# Altium schematic sheet Sheet5.SchDoc
size A4; SheetNumber: 5; SheetTotal: 6
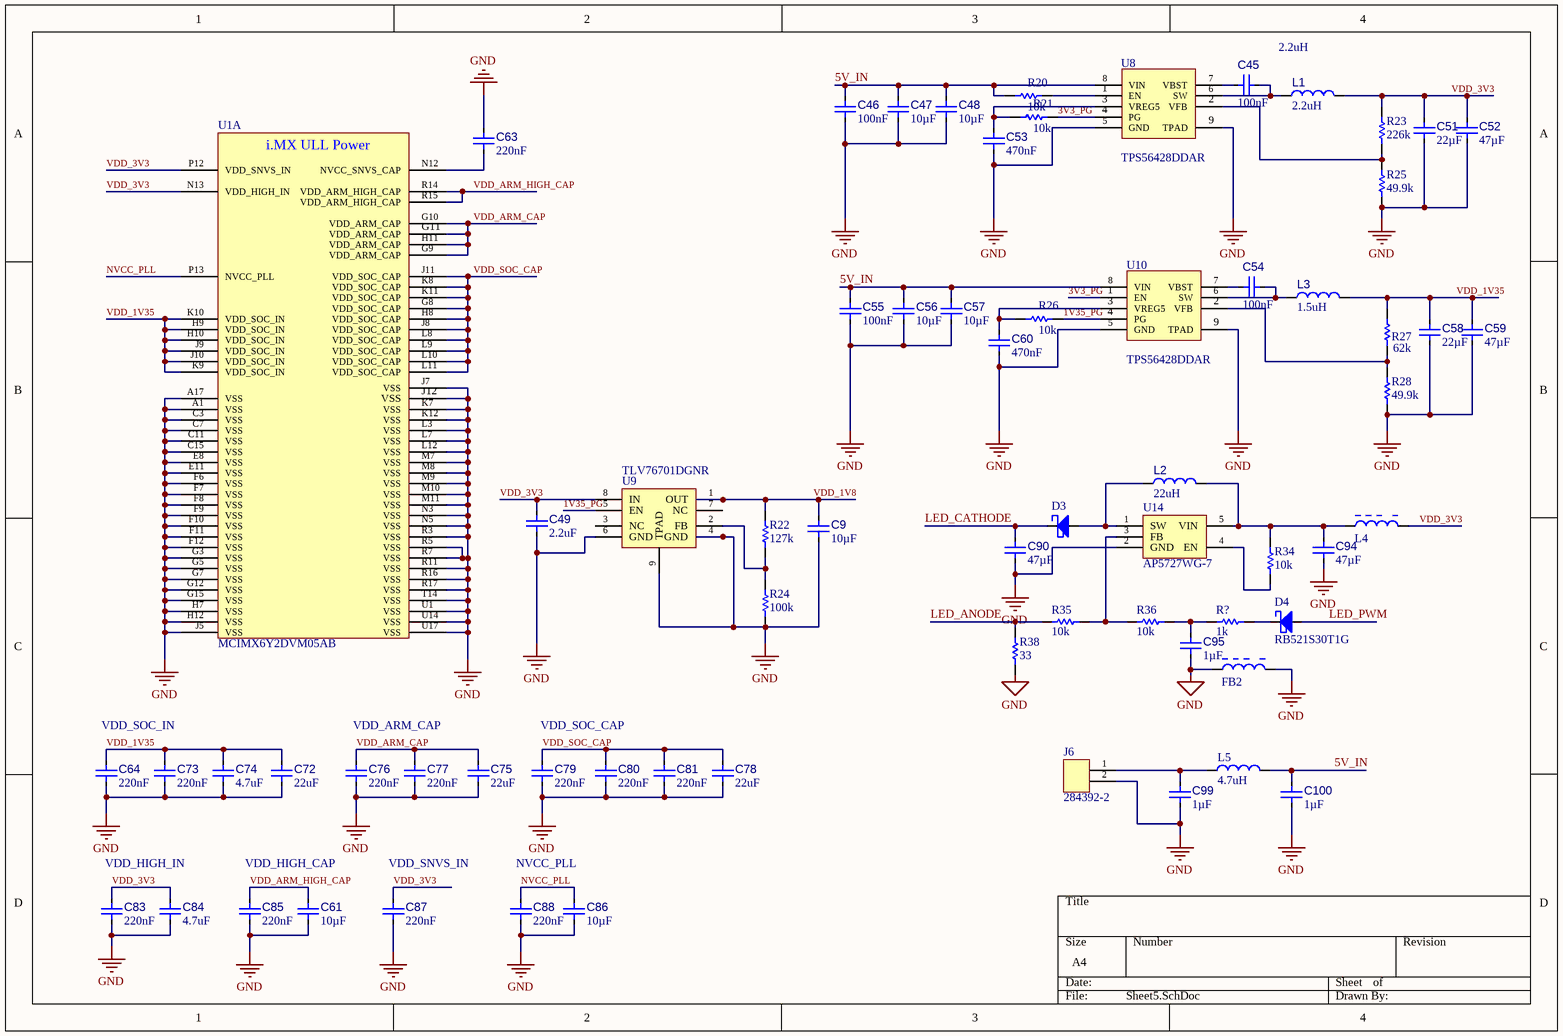
[diagram p0: Sheet5.SchDoc]

## Parts
C9  value 10µF  [0805-SMD-CAP]  (hidden comment: 0805YD106KAT2A)
C45  value 100nF  [0402-SMD-CAP]  (hidden comment: EMF105B7104MVHF)
C46  value 100nF  [0402-SMD-CAP]  (hidden comment: EMF105B7104MVHF)
C47  value 10µF  [0805-SMD-CAP]  (hidden comment: 0805YD106KAT2A)
C48  value 10µF  [0805-SMD-CAP]  (hidden comment: 0805YD106KAT2A)
C49  value 2.2uF  [0603-SMD-CAP]  (hidden comment: GRM188R71A225KE15D)
C51  value 22µF  [0805-SMD-CAP]  (hidden comment: CL21A226MOQNNNE)
C52  value 47µF  [0805-SMD-CAP]  (hidden comment: CL21A476MQYNNNE)
C53  value 470nF  [0402-SMD-CAP]  (hidden comment: CL05A474KP5NNNC)
C54  value 100nF  [0402-SMD-CAP]  (hidden comment: EMF105B7104MVHF)
C55  value 100nF  [0402-SMD-CAP]  (hidden comment: EMF105B7104MVHF)
C56  value 10µF  [0805-SMD-CAP]  (hidden comment: 0805YD106KAT2A)
C57  value 10µF  [0805-SMD-CAP]  (hidden comment: 0805YD106KAT2A)
C58  value 22µF  [0805-SMD-CAP]  (hidden comment: CL21A226MOQNNNE)
C59  value 47µF  [0805-SMD-CAP]  (hidden comment: CL21A476MQYNNNE)
C60  value 470nF  [0402-SMD-CAP]  (hidden comment: CL05A474KP5NNNC)
C61  value 10µF  [0402-SMD-CAP]  (hidden comment: GRM155R60J106ME15D)
C63  value 220nF  [0402-SMD-CAP]  (hidden comment: GRM155R71C224KA12D)
C64  value 220nF  [0402-SMD-CAP]  (hidden comment: GRM155R71C224KA12D)
C72  value 22uF  [0603-SMD-CAP]  (hidden comment: GRM188R61A226ME15D)
C73  value 220nF  [0402-SMD-CAP]  (hidden comment: GRM155R71C224KA12D)
C74  value 4.7uF  [0603-SMD-CAP]  (hidden comment: C0603C475K9PACTU)
C75  value 22uF  [0603-SMD-CAP]  (hidden comment: GRM188R61A226ME15D)
C76  value 220nF  [0402-SMD-CAP]  (hidden comment: GRM155R71C224KA12D)
C77  value 220nF  [0402-SMD-CAP]  (hidden comment: GRM155R71C224KA12D)
C78  value 22uF  [0603-SMD-CAP]  (hidden comment: GRM188R61A226ME15D)
C79  value 220nF  [0402-SMD-CAP]  (hidden comment: GRM155R71C224KA12D)
C80  value 220nF  [0402-SMD-CAP]  (hidden comment: GRM155R71C224KA12D)
C81  value 220nF  [0402-SMD-CAP]  (hidden comment: GRM155R71C224KA12D)
C83  value 220nF  [0402-SMD-CAP]  (hidden comment: GRM155R71C224KA12D)
C84  value 4.7uF  [0603-SMD-CAP]  (hidden comment: C0603C475K9PACTU)
C85  value 220nF  [0402-SMD-CAP]  (hidden comment: GRM155R71C224KA12D)
C86  value 10µF  [0402-SMD-CAP]  (hidden comment: GRM155R60J106ME15D)
C87  value 220nF  [0402-SMD-CAP]  (hidden comment: GRM155R71C224KA12D)
C88  value 220nF  [0402-SMD-CAP]  (hidden comment: GRM155R71C224KA12D)
C90  value 47µF  [0805-SMD-CAP]  (hidden comment: CL21A476MQYNNNE)
C94  value 47µF  [0805-SMD-CAP]  (hidden comment: CL21A476MQYNNNE)
C95  value 1µF  [0402-SMD-CAP]  (hidden comment: 04026D105KAT2A)
C99  value 1µF  [0805-SMD-CAP]  (hidden comment: CC0805KKX7R8BB105)
C100  value 1µF  [0805-SMD-CAP]  (hidden comment: CC0805KKX7R8BB105)
D3  BAT46W-HE3-08  [BAT46WH-HE3-08]  (value not drawn)
D4  RB521S30T1G  [ONSC-SOD-523-2-502-01_V]
FB2  BLM21BB221SN1D  [MURA-BLM21-H1-CHIP-2_V]  (value not drawn)
J6  284392-2  [284392-2-Footprint-1]
L1  value 2.2uH  Inductance: 2.2uH  [1008-SMD-IND]  (hidden comment: 74438322022)
L2  value 22uH  [BOUR-SRN3015-2_V]  (hidden comment: SRN3015-220M)
L3  value 1.5uH  [1008-SMD-IND]  (hidden comment: DFE252012P-1R5M=P2)
L4  BK1608LM252-T  [0603-SMD-IND]  (value not drawn)
L5  Inductance: 4.7uH  [TYA2520104R7M-10-Footprint-1]  (hidden comment: TYA2520104R7M-10)
R20  value 10k  [0402_SMD_RES]  (hidden comment: CRCW040210K0FKTD)
R21  value 10k  [0402_SMD_RES]  (hidden comment: CRCW040210K0FKTD)
R22  value 127k  [0402_SMD_RES]  (hidden comment: ERJ-2RKF1273X)
R23  value 226k  [0402_SMD_RES]  (hidden comment: ERJ-2RKF2263X)
R24  value 100k  [0402_SMD_RES]  (hidden comment: RC0402FR-07100KL)
R25  value 49.9k  [0402_SMD_RES]  (hidden comment: ERJ-2RKF4992X)
R26  value 10k  [0402_SMD_RES]  (hidden comment: CRCW040210K0FKTD)
R27  value 62k  [0402_SMD_RES]  (hidden comment: CRCW040262K0FKED)
R28  value 49.9k  [0402_SMD_RES]  (hidden comment: ERJ-2RKF4992X)
R34  value 10k  [0402_SMD_RES]  (hidden comment: Resistor 10k +/-1% 0402 63 mW)
R35  value 10k  [0402_SMD_RES]  (hidden comment: Resistor 10k +/-1% 0402 63 mW)
R36  value 10k  [0402_SMD_RES]  (hidden comment: Resistor 10k +/-1% 0402 63 mW)
R38  value 33  [0402_SMD_RES]  (hidden comment: RC0402JR-0733RL)
R?  value 1k  [0402_SMD_RES]  (hidden comment: ERJ-2RKF1001X)
U1  MCIMX6Y2DVM05AB  [BGA100P9X9-81A]  (part A of 11)
U8  TPS56428DDAR  [SOP127P600X170_HS-9L]
U9  TLV76701DGNR  [TSOP65P490X110_HS-9L]
U10  TPS56428DDAR  [SOP127P600X170_HS-9L]
U14  AP5727WG-7  [SOT95P285X145-5N]

## Nets
GND: C9.2 C46.2 C47.2 C48.2 C49.1 C51.2 C52.2 C53.2 C55.2 C56.2 C57.2 C58.2 C59.2 C60.2 C61.2 C63.1 C64.2 C72.2 C73.2 C74.2 C75.2 C76.2 C77.2 C78.2 C79.2 C80.2 C81.2 C83.2 C84.2 C85.2 C86.2 C87.2 C88.2 C90.2 C94.2 C95.2 C99.2 C100.2 FB2.1 FB2.2 J6.2 R24.1 R25.1 R28.1 R38.1 U1.A1(VSS) U1.A17(VSS) U1.C3(VSS) U1.C7(VSS) U1.C11(VSS) U1.C15(VSS) U1.E8(VSS) U1.E11(VSS) U1.F6(VSS) U1.F7(VSS) U1.F8(VSS) U1.F9(VSS) U1.F10(VSS) U1.F11(VSS) U1.F12(VSS) U1.G3(VSS) U1.G5(VSS) U1.G7(VSS) U1.G12(VSS) U1.G15(VSS) U1.H7(VSS) U1.H12(VSS) U1.J5(VSS) U1.J7(VSS) U1.J12(VSS) U1.K7(VSS) U1.K12(VSS) U1.L3(VSS) U1.L7(VSS) U1.L12(VSS) U1.M7(VSS) U1.M8(VSS) U1.M9(VSS) U1.M10(VSS) U1.M11(VSS) U1.N3(VSS) U1.N5(VSS) U1.R3(VSS) U1.R5(VSS) U1.R7(VSS) U1.R11(VSS) U1.R16(VSS) U1.R17(VSS) U1.T14(VSS) U1.U1(VSS) U1.U14(VSS) U1.U17(VSS) U8.5(GND) U8.9(TPAD) U9.4(GND) U9.6(GND) U9.9(TPAD) U10.5(GND) U10.9(TPAD) U14.2(GND)
1V35_PG: R26.2 U9.5(EN) U10.4(PG)
3V3_PG: R21.2 U8.4(PG) U10.1(EN)
5V_IN: C46.1 C47.1 C48.1 C55.1 C56.1 C57.1 C100.1 L5.2 R20.1 U8.8(VIN) U10.8(VIN)
LED_ANODE: R35.2 R38.2
LED_CATHODE: C90.1 D3.2(K)
LED_PWM: D4.1(A)
NVCC_PLL: C86.1 C88.1 U1.P13(NVCC_PLL)
VDD_1V8: C9.1 R22.2 U9.1(OUT)
VDD_1V35: C58.1 C59.1 C64.1 C72.1 C73.1 C74.1 L3.2 R27.2 U1.H9(VDD_SOC_IN) U1.H10(VDD_SOC_IN) U1.J9(VDD_SOC_IN) U1.J10(VDD_SOC_IN) U1.K9(VDD_SOC_IN) U1.K10(VDD_SOC_IN)
VDD_3V3: C49.2 C51.1 C52.1 C83.1 C84.1 C87.1 L1.2 L4.2 R23.2 U1.N13(VDD_HIGH_IN) U1.P12(VDD_SNVS_IN) U9.8(IN)
VDD_ARM_CAP: C75.1 C76.1 C77.1 U1.G9(VDD_ARM_CAP) U1.G10(VDD_ARM_CAP) U1.G11(VDD_ARM_CAP) U1.H11(VDD_ARM_CAP)
VDD_ARM_HIGH_CAP: C61.1 C85.1 U1.R14(VDD_ARM_HIGH_CAP) U1.R15(VDD_ARM_HIGH_CAP)
VDD_SOC_CAP: C78.1 C79.1 C80.1 C81.1 U1.G8(VDD_SOC_CAP) U1.H8(VDD_SOC_CAP) U1.J8(VDD_SOC_CAP) U1.J11(VDD_SOC_CAP) U1.K8(VDD_SOC_CAP) U1.K11(VDD_SOC_CAP) U1.L8(VDD_SOC_CAP) U1.L9(VDD_SOC_CAP) U1.L10(VDD_SOC_CAP) U1.L11(VDD_SOC_CAP)
NetC45_1: C45.1 L1.1 U8.6(SW)
NetC45_2: C45.2 U8.7(VBST)
NetC53_1: C53.1 R21.1 U8.3(VREG5)
NetC54_1: C54.1 L3.1 U10.6(SW)
NetC54_2: C54.2 U10.7(VBST)
NetC60_1: C60.1 R26.1 U10.3(VREG5)
NetC63_2: C63.2 U1.N12(NVCC_SNVS_CAP)
NetC94_1: C94.1 L2.2 L4.1 R34.1 U14.5(VIN)
NetC95_1: C95.1 R36.1 R?.2
NetC99_1: C99.1 J6.1 L5.1
NetD3_1: D3.1(A) L2.1 U14.1(SW)
NetD4_2: D4.2(K) R?.1
NetR20_2: R20.2 U8.1(EN)
NetR22_1: R22.1 R24.2 U9.2(FB)
NetR23_1: R23.1 R25.2 U8.2(VFB)
NetR27_1: R27.1 R28.2 U10.2(VFB)
NetR34_2: R34.2 U14.4(EN)
NetR35_1: R35.1 R36.2 U14.3(FB)

Not connected (* = marked no-connect by the designer): U9 3(NC) 7(NC)

## Notes on the sheet
- VDD_SOC_IN
- VDD_ARM_CAP
- VDD_SOC_CAP
- VDD_HIGH_IN
- VDD_HIGH_CAP
- (near C87) VDD_SNVS_IN
- NVCC_PLL
- (in symbol CMP-003-000001-14, part A) i.MX ULL Power

## Library data of the parts
C9 C47 C48 C56 C57 = CMP-001-00015-12: Chip Capacitor, 10 uF, +/- 10%, 16 V, 0805 (2012 Metric); Capacitor Type: Ceramic; Voltage Rating: 16V; Pins: 2; Mounting Technology: SM; Max Operating Temperature: 85°C; Tolerance: 10%; Case/Package: 0805; RoHS Compliant: True; Min Operating Temperature: -55°C; Mfr. Part No.: 0805YD106KAT2A
C45 C46 C54 C55 = CMP-001-00001-14: Chip Capacitor, 0.1 uF, +/- 5%, 16 V, 0402 (1005 Metric); Capacitor Type: Ceramic; Voltage Rating: 16V; Case/Package: 0402; Max Operating Temperature: 125°C; Mounting Technology: SM; RoHS Compliant: True; Pins: 2; Min Operating Temperature: -55°C; Tolerance: 5%; Mfr. Part No.: EMF105B7104MVHF
C49 = CMP-001-00083-8: CAP CER 2.2UF 10V X7R 0603; Tolerance: 10%; Material: Ceramic; Height: 0.8mm; Capacitance: 2.2uF; Case Code (Imperial): 0603; Termination: Standard; Voltage Rating (DC): 10V; Voltage: 10V; RoHS Compliant: Yes; Length: 1.6mm; Thickness: 0.035inch; Case Code (Metric): 1608; REACH SVHC: No SVHC; Package Quantity: 4000; Case/Package: 0603; Mount: Surface Mount; Depth: 0.8mm; Packaging: Cut Tape; Lead Free: Lead Free; Series: GRM; Width: 0.8mm; Dielectric: X7R; Number of Pins: 2; Weight: 0.000222oz; Max Operating Temperature: 125°C; Voltage Rating: 10V; Min Operating Temperature: -55°C
C51 C58 = CMP-001-00081-10: Chip Capacitor, 22µF +/-40%, 16V, 0805, Thickness 1.45 mm; Tolerance: 5%; Max Operating Temperature: 85°C; Case/Package: 0805; Pins: 2; Voltage Rating: 16V; Min Operating Temperature: -55°C; Mounting Technology: SMT; Mfr. Part No.: CL21A226MOQNNNE
C52 C59 C90 C94 = CMP-001-00082-10: Chip Capacitor, 47µF +/-40%, 6.3V, 0805, Thickness 1.45 mm; Tolerance: 10%; Max Operating Temperature: 85°C; Voltage Rating: 6.3V; Case/Package: 0805; Mounting Technology: SMT; Pins: 2; Min Operating Temperature: -55°C; Mfr. Part No.: CL21A476MQYNNNE
C53 C60 = CMP-001-00060-12: Chip Capacitor, 470nF +/-40%, 10V, 0402, Thickness 0.6 mm; Tolerance: 20%; Voltage Rating: 10V; Pins: 2; Case/Package: 0402; Max Operating Temperature: 85°C; Mounting Technology: SMT; Min Operating Temperature: -55°C; Mfr. Part No.: CL05A474KP5NNNC
C61 C86 = CMP-001-00074-10: Chip Capacitor, 10µF +/-40%, 6.3V, 0402, Thickness 0.6 mm; Tolerance: 10%; Pins: 2; Mounting Technology: SMT; Max Operating Temperature: 85°C; Case/Package: 0402; Voltage Rating: 6.3V; Min Operating Temperature: -55°C; Mfr. Part No.: GRM155R60J106ME15D
C63 C64 C73 C76 C77 C79-C81 C83 C85 C87 C88 = CMP-001-00090-10: MURATA - GRM155R71C224KA12D - SMD Multilayer Ceramic Capacitor, 0.22 µF, 16 V, 0402 [1005 Metric], ± 10%, X7R, GRM Series; Voltage: 16V; Package Quantity: 1; Height: 0.5mm; Tolerance: 10%; Case/Package: 0402; Case Code (Metric): 1005; Packaging: Tape and Reel; Min Operating Temperature: -55°C; Mount: Surface Mount; RoHS Compliant: Yes; Thickness: 0.022inch; Depth: 0.5mm; Lead Free: Lead Free; Series: GRM; REACH SVHC: No SVHC; Width: 0.02inch; Voltage Rating: 16V; Material: Ceramic; Radiation Hardening: No; Voltage Rating (DC): 16V; Capacitance: 220nF; Max Operating Temperature: 125°C; Length: 1mm; Construction: Flat; Dielectric: X7R; Termination: SMD/SMT; Case Code (Imperial): 0402
C72 C75 C78 = CMP-001-00094-3: 0603 22 uF 10 V ±20% Tolerance X5R Multilayer Ceramic Chip Capacitor; Voltage Rating: 10V; Max Operating Temperature: 85°C; Dielectric: X5R; Thickness: 0.039inch; Width: 0.8mm; Material: Ceramic; Height: 0.8mm; Mount: Surface Mount; Case Code (Imperial): 0603; Termination: SMD/SMT; Length: 1.6mm; Packaging: Tape and Reel; Package Quantity: 4000; Depth: 0.8mm; Voltage Rating (DC): 10V; REACH SVHC: No SVHC; Case Code (Metric): 1608; Weight: 0.000222oz; Capacitance: 22uF; Min Operating Temperature: -55°C; Case/Package: 0603; Lead Free: Lead Free; Tolerance: 20%; RoHS Compliant: Yes
C74 C84 = CMP-001-00092-7: KEMET - C0603C475K9PACTU - SMD Multilayer Ceramic Capacitor, 4.7 µF, 6.3 V, 0603 [1608 Metric], ± 10%, X5R, C Series KEMET; Dissipation Factor: 5%; Voltage Rating: 6.3V; Radiation Hardening: No; Lead Pitch: 0.7mm; Case Code (Metric): 1608; Case Code (Imperial): 0603; Length: 1.6mm; Series: C; Dielectric Material: Ceramic; Height: 0.8mm; Package Quantity: 1; Termination: SMD/SMT; Dielectric: X5R; Thickness: 0.035inch; Mount: Surface Mount,PCB; Construction: Flat; Capacitance: 4.7uF; RoHS Compliant: Yes; REACH SVHC: No SVHC; Tolerance: 10%; Number of Pins: 2; Width: 0.031inch; Contact Plating: Tin,Matte; Packaging: Tape and Reel; Case/Package: 0603; Max Operating Temperature: 85°C; Lead Free: Lead Free; Depth: 0.8mm; Voltage: 6.3V; Min Operating Temperature: -55°C; Voltage Rating (DC): 6.3V
C95 = CMP-001-00008-17: Chip Capacitor, 1 uF, +/- 10%, 6.3 V, 0402 (1005 Metric); Voltage Rating: 6.3V; Capacitor Type: Ceramic; Dielectric: X5R; RoHS Compliant: True; Case/Package: 0402; Min Operating Temperature: -55°C; Mounting Technology: SM; Max Operating Temperature: 85°C; Pins: 2; Tolerance: 10%
C99 C100 = CMP-001-00010-13: Chip Capacitor, 1 uF, +/-10%, 25 V, 0805 (2012 Metric); Tolerance: 10%; Voltage Rating: 25V; Capacitor Type: Ceramic; Dielectric: X7R; Min Operating Temperature: -55°C; Max Operating Temperature: 125°C; Case/Package: 0805; RoHS Compliant: True; Pins: 2; Mounting Technology: SM; Mfr. Part No.: CC0805KKX7R8BB105
D3 = CMP-004-00033-6: Diode Small Signal Schottky 100V 0.15A Automotive 2-Pin SOD-123 T/R; Forward Voltage: 1V; Max Power Dissipation: 150mW; Peak Non-Repetitive Surge Current: 750mA; Max Reverse Current: 5uA; Average Rectified Current: 150mA; Element Configuration: Single; Mount: Surface Mount; Number of Pins: 2; Max Forward Surge Current (Ifsm): 750mA; Min Operating Temperature: -55°C; RoHS Compliant: Yes; Lead Free: Lead Free; Weight: 0.000363oz; Packaging: Tape and Reel; Max Reverse Voltage (DC): 100V; Package Quantity: 3000; Max Operating Temperature: 125°C; Max Repetitive Reverse Voltage (Vrrm): 100V; Forward Current: 150mA
D4 = CMP-004-00031-4: ON SEMICONDUCTOR - RB521S30T1G - Small Signal Schottky Diode, Single, 30 V, 200 mA, 500 mV, 1 A, 125 °C; Max Repetitive Reverse Voltage (Vrrm): 30V; Max Reverse Current: 30uA; Forward Voltage: 500mV; Forward Current: 200mA; Max Surge Current: 1A; Polarity: Standard; Power Dissipation: 200mW; Radiation Hardening: No; Min Operating Temperature: -55°C; Lead Free: Lead Free; REACH SVHC: No SVHC; Length: 1.3mm; Package Quantity: 1; Contact Plating: Tin,Matte; Average Rectified Current: 200mA; RoHS Compliant: Yes; Max Operating Temperature: 125°C; Number of Pins: 2; Peak Non-Repetitive Surge Current: 1A; Voltage Rating (DC): 30V; Packaging: Tape and Reel; Case/Package: SOD-523-2; Max Forward Surge Current (Ifsm): 1A; Max Reverse Leakage Current: 30uA; Current Rating: 200mA; Max Reverse Voltage (DC): 30V; Height: 0.7mm; Element Configuration: Single; Output Current: 200mA; Width: 0.9mm
FB2 = CMP-006-00021-8: FERRITE CHIP 220 OHM 0805; Current Rating: 500mA; Tolerance: 25%; Test Frequency: 100MHz; Number of Circuits: 1; DC Resistance-Max: 260mR; Material: Ferrite,Steel; Impedance: 220R; Resistance: 350mR; Max DC Current: 200mA; Shielding: Unshielded; Depth: 1.25mm; Max Current Rating: 500mA; Case Code (Imperial): 0805; Case/Package: 0805; Max Operating Temperature: 125°C; Package Quantity: 4000; Width: 1.25mm; Height: 0.85mm; Number of Pins: 2; Min Operating Temperature: -55°C; Termination: SMD/SMT; Length: 2mm; Number of Lines: 1; DC Resistance (DCR): 260mR; Case Code (Metric): 2012; Lead Free: Lead Free; RoHS Compliant: Yes; REACH SVHC: No SVHC; Packaging: Tape and Reel; Series: BLM21B; Core Material: Ferrite
J6 = CMP-002-00076-3: Conn Terminal Block 2 POS 3.81mm Solder ST Thru-Hole 12A/Contact; Tail Length: 3.5mm; Current Rating: 12A; Pitch: 0.1499inch; Wire Gauge (Max): 30AWG; Number of Circuits: 2; Plating: Brass; Voltage Rating: 300V; Shrouded: Yes (With); Closed End: No (Without); Wire Gauge (Min): 14AWG; Thread Size: M3; Connector Type: Receptacle; Number of Levels: 1; Radiation Hardening: No; Max Operating Temperature: 105°C; Orientation: Straight; Termination: Solder; Packaging: Box; Housing Color: Green; Contact Plating: Tin; Depth: 8.2mm; Color: Green; Mount: Through Hole; Contact Material: Brass; Current: 12A; Number of Contacts: 2; Min Operating Temperature: -40°C; Number of Positions: 2; Number of Poles: 2; ELV: Compliant; Side Stackable: Yes (With); Screwless Terminal Block: No (Without); Number of Positions Per Level: 2; Max Voltage Rating (AC): 300V; Length: 8.12mm; Series: Buchanan; Voltage: 300V; Interlock: Yes (With); Screw Flange: No (Without); Lead Free: Lead Free; Max Supply Voltage (AC): 300V; Max Current Rating: 12A; RoHS Compliant: Yes; Flammability Rating: UL94 V-0; Housing Material: Polyamide; Number of Rows: 1; Package Quantity: 300
L1 = CMP-006-00027-4: Inductor, SMD 2.2 uH 1.34 A ±30%, 74438322022, Würth Elektronik; Current Rating: 1.34A; Saturation Current: 2.2A; Test Frequency: 100kHz; Core Material: Metal,Composite,Ferrite; Shielding: Shielded; DC Resistance (DCR): 302mR; Series Resistance: 252mR; Self Resonant Frequency: 60MHz; Height: 0.8mm; Case Code (Imperial): 1008; Min Operating Temperature: -40°C; Mount: Surface Mount; Length: 2.5mm; RoHS Compliant: Yes; Width: 0.079inch; Package Quantity: 3000; Tolerance: 30%; Case Code (Metric): 2520; Max DC Current: 1.34A; Max Operating Temperature: 125°C; Termination: SMD/SMT; Depth: 2mm; Weight: 0.001129oz; Case/Package: SMD/SMT; RMS Current (Irms): 1.34A; Inductance Tolerance: 30%; REACH SVHC: Unknown; Height - Seated (Max): 0.031inch; Packaging: Tape and Reel
L2 = CMP-006-00026-4: BOURNS   SRN3015-220M   INDUCTOR, SHIELDED, 22UH, 580MA, SMD; DC Current: 600mA; Core Material: Ferrite; Tolerance: 20%; Self Resonant Frequency: 28MHz; Test Frequency: 1MHz; DC Resistance (DCR): 622mR; Max Operating Temperature: 125°C; Contact Plating: Tin; Current Rating: 600mA; Inductance: 22uH; Depth: 3.1mm; Height: 1.5mm; Weight: 0.001235oz; Width: 0.118inch; RoHS Compliant: Yes; Min Operating Temperature: -40°C; Saturation Current: 580mA; Shielding: Shielded; Max DC Current: 600mA; Number of Pins: 2; Resistor Type: Wirewound; Case/Package: 1212; REACH SVHC: No SVHC; Inductance Tolerance: 20%; Series: SRN3015; Height - Seated (Max): 0.059inch; Packaging: Tape and Reel; RMS Current (Irms): 600mA; Military Standard: Not; Termination: SMD/SMT; Length: 3.1mm; Package Quantity: 2000
L3 = CMP-006-00028-3: Ind Metal Alloy Shielded 1.5uH 20% 1MHz Powdered Iron 2.6A 1008 T/R; Current Rating: 3.5A; DC Resistance (DCR): 60mR; Core Material: Ferrite; Height - Seated (Max): 0.039inch; Depth: 2mm; Max DC Current: 2.6A; Length: 0.098inch; Inductance: 1.5uH; Mount: Surface Mount; Case/Package: 1008; Max Operating Temperature: 125°C; Packaging: Tape and Reel; Case Code (Imperial): 1008; Test Frequency: 1MHz; Min Operating Temperature: -40°C; Shielding: Shielded; Case Code (Metric): 2520; RoHS Compliant: Yes; Resistor Type: Wirewound,Metal Alloy; Width: 0.079inch; Tolerance: 20%
L4 = CMP-006-00024-6: GLOVE, POLYAMIDE, L/FREE, PU, SIZE 6 - More Details; Impedance: 2.5kR; Max DC Current: 200mA; Frequency: 100MHz; Core Material: Ferrite; Number of Lines: 1; DC Resistance (DCR): 1.1R; Shielding: Shielded; Tolerance: 25%; Termination: SMD/SMT; Height: 0.95mm; Min Operating Temperature: -55°C; Width: 0.8mm; Number of Pins: 2; Length: 0.063inch; Halogen Free: Halogen Free; Max Current Rating: 200mA; Case/Package: 0603; Lead Free: Lead Free; Package Quantity: 1; Depth: 0.95mm; Packaging: Tape and Reel; Case Code (Imperial): 0603; Series: BK; Max Operating Temperature: 125°C; Case Code (Metric): 1608; REACH SVHC: Unknown; RoHS Compliant: Yes; Test Frequency: 100MHz; Mount: Surface Mount
L5 = CMP-006-00025-2: Fixed Inductors 4.7uH 1.3A 20% Wire Wound; DC Resistance (DCR): 290mR; Value: 4.7uH; Current Rating: 1.3A; Inductance Tolerance: 20%
R20 R21 R26 = CMP-009-00149-9: Chip Resistor, 10 kOhms, +/-1 %, 63 mW, -55 to 125 degC, 0402; Power: 63mW; Tolerance: 1%; Pins: 2; Max Operating Temperature: 155°C; Min Operating Temperature: -55°C; Case/Package: 0402; Mfr. Part No.: CRCW040210K0FKTD
R22 = CMP-009-00185-7: PANASONIC ELECTRONIC COMPONENTS         ERJ2RKF1273X            Surface Mount Chip Resistor, Thick Film, AEC-Q200 ERJ2R Series, 127 kohm, 100 mW,  1%, 50 V; Max Power Dissipation: 100mW; Voltage Rating (DC): 50V; Temperature Coefficient: 100ppm/°C; Construction: Rectangular; Height: 0.35mm; Depth: 0.5mm; Width: 0.02inch; Packaging: Tape and Reel; Radiation Hardening: No; Technology: THICK FILM; Contact Plating: Tin; Length: 1mm; Series: ERJ; Features: Automotive AEC-Q200; Package Quantity: 1; Resistance Tolerance: 1%; Mount: Surface Mount; Case Code (Imperial): 0402; Termination: SMD/SMT; Voltage Rating: 50V; Tolerance: 1%; Case/Package: 0402; Power Rating: 100mW; Resistance: 127k; Case Code (Metric): 1005; Resistor Type: Thick Film; Military Standard: Not; Number of Terminations: 2; RoHS Compliant: Yes; Lead Free: Lead Free; REACH SVHC: No SVHC; Min Operating Temperature: -55°C; Max Operating Temperature: 155°C
R23 = CMP-009-00186-7: Res Thick Film 0402 226K Ohm 1% 1/10W 100ppm/C Molded SMD SMD Punched Carrier T/R; Voltage Rating: 50V; Power Rating: 100mW; Temperature Coefficient: 100ppm/°C; Min Operating Temperature: -55°C; Contact Plating: Tin; Construction: Rectangular; Weight: 2.8E-05oz; Voltage Rating (DC): 50V; Packaging: Tape and Reel; Case/Package: 0402; Resistance Tolerance: 1%; Resistance: 226k; Width: 0.5mm; Package Quantity: 1; Military Standard: Not; Features: Automotive AEC-Q200; Resistor Type: Thick Film; Series: ERJ; Case Code (Metric): 1005; Technology: THICK FILM; Number of Terminations: 2; Lead Free: Lead Free; Depth: 0.5mm; Tolerance: 1%; Case Code (Imperial): 0402; Max Operating Temperature: 155°C; Radiation Hardening: No; Length: 1mm; Mount: Surface Mount; REACH SVHC: Unknown; Height: 0.35mm; Termination: SMD/SMT; Max Power Dissipation: 100mW; RoHS Compliant: Yes
R24 = CMP-009-00021-11: Chip Resistor, 100 KOhm, +/- 1%, 0.063 W, -55 to 155 degC, 0402 (1005 Metric); Voltage Rating: 50V; Power: 63mW; RoHS Compliant: True; Max Operating Temperature: 155°C; Tolerance: 1%; Min Operating Temperature: -55°C; Case/Package: 0402; Mounting Technology: SM; Pins: 2; Mfr. Part No.: RC0402FR-07100KL
R25 R28 = CMP-009-00187-7: PANASONIC ELECTRONIC COMPONENTS - ERJ-2RKF4992X. - Resistance:49.9kohm; Max Power Dissipation: 100mW; Tolerance: 1%; Voltage Rating: 50V; Temperature Coefficient: 100ppm/°C; Packaging: Tape and Reel; Resistor Type: Thick Film; Lead Free: Lead Free; Resistance: 49.9k; Height: 0.35mm; Series: ERJ; REACH SVHC: No SVHC; Number of Terminations: 2; Technology: THICK FILM; Voltage Rating (DC): 50V; Mount: Surface Mount; Contact Plating: Tin; Military Standard: Not; RoHS Compliant: Yes; Resistance Tolerance: 1%; Radiation Hardening: No; Depth: 0.5mm; Size Code: 0402; Termination: SMD/SMT; Power Rating: 100mW; Max Operating Temperature: 155°C; Width: 0.02inch; Case Code (Metric): 1005; Features: Automotive AEC-Q200; Length: 1mm; Case/Package: 0402; Case Code (Imperial): 0402; Package Quantity: 1; Min Operating Temperature: -55°C; Construction: Rectangular
R27 = CMP-009-00188-7: CRCW Series 0402 0.063 W 62 kOhm ±1 % ±100 ppm/K Rectangular SMT Chip Resistor; Temperature Coefficient: 100ppm/°C; Tolerance: 1%; Voltage Rating (DC): 50V; Power Rating: 63mW; Length: 1mm; Case Code (Imperial): 0402; Resistance Tolerance: 1%; Weight: 2.3E-05oz; Min Operating Temperature: -55°C; Max Operating Temperature: 155°C; Construction: Rectangular; Technology: THICK FILM; Radiation Hardening: No; RoHS Compliant: Yes; Military Standard: Not; Lead Free: Lead Free; Series: CRCW; Voltage Rating: 50V; Number of Terminations: 2; Features: Automotive AEC-Q200; Packaging: Tape and Reel; Package Quantity: 10; Case Code (Metric): 1005; REACH SVHC: Unknown; Depth: 0.5mm; Termination: SMD/SMT; Case/Package: 0402; Height: 0.35mm; Resistance: 62k; Max Power Dissipation: 63mW; Resistor Type: Thick Film; Size Code: 0402; Number of Pins: 2; Width: 0.02inch; Contact Plating: Tin
R34-R36 = CMP-009-00019-13: Chip Resistor, 10 KOhm, +/- 1%, 63 mW, -55 to 155 degC, 0402 (1005 Metric); Voltage Rating: 50V; Power: 63mW; Min Operating Temperature: -55°C; Pins: 2; Case/Package: 0402; Max Operating Temperature: 155°C; Resistance: 10k; Mounting Technology: SM; RoHS Compliant: True; Tolerance: 1%
R38 = CMP-009-00143-9: Chip Resistor, 33 Ohms, +/-5 %, 63 mW, -55 to 155 degC, 0402; Tolerance: 5%; Power: 63mW; Pins: 2; Case/Package: 0402; Min Operating Temperature: -55°C; Max Operating Temperature: 155°C; Mfr. Part No.: RC0402JR-0733RL
R? = CMP-009-00009-12: Chip Resistor, 1 KOhm, +/- 1%, 0.1 W, -55 to 155 degC, 0402 (1005 Metric); Power: 100mW; Voltage Rating: 50V; RoHS Compliant: True; Case/Package: 0402; Mounting Technology: SM; Pins: 2; Max Operating Temperature: 155°C; Min Operating Temperature: -55°C; Tolerance: 1%; Mfr. Part No.: ERJ-2RKF1001X
U1 = CMP-003-000001-14: Package: MAPBGA; Design Item ID: MCIMX6Y2DVM05AB; Mfr. Part Nr.: MCIMX6Y2DVM05AB; Source: Schlib1.SchLib
U8 U10 = CMP-00000-11: IC REG BCK ADJ 4A SYNC 8SOPWRPAD; Output Type: Adjustable; Max Output Voltage: 7V; Operating Supply Voltage: 18V; Min Output Voltage: 600mV; Number of Outputs: 1; Output Configuration: Positive; Synchronous Rectifier: Yes; Min Input Voltage: 4.5V; Switching Frequency: 650kHz; Quiescent Current: 250uA; Min Operating Temperature: -40°C; Max Operating Temperature: 85°C; Radiation Hardening: No; Output Voltage: 7V; Case/Package: HSOP; Series: D-CAP2™, Eco-Mode™; Packaging: Tape and Reel; Lead Free: Lead Free; Package Quantity: 2500; Max Input Voltage: 18V; Max Output Current: 4A; Output Current: 4A; Number of Pins: 8; Mount: Surface Mount
U9 = CMP-003-000000-7: 1A 16V LDO; Design Item ID: TLV76701DGNR; Source: Schlib1.SchLib; Package: HVSSOP
U14 = CMP-019-00054-6: LED DRVR 3.3V/5V 5-Pin SOT-25 T/R; Max Supply Current: 750mA; Operating Supply Current: 500uA; Max Supply Voltage: 5.5V; Min Supply Voltage: 2.7V; Radiation Hardening: No; Max Operating Temperature: 85°C; Series: -; Lead Free: Lead Free; Packaging: Tape and Reel; Mount: Surface Mount; Height: 1.3mm; Min Operating Temperature: -40°C; Number of Pins: 5; Contact Plating: Tin,Matte; REACH SVHC: No SVHC; Case/Package: SOT-25; Width: 1.7mm; Package Quantity: 3000; Length: 3.1mm; RoHS Compliant: Yes